# Altium project 220 volts dimmer.PrjPcb
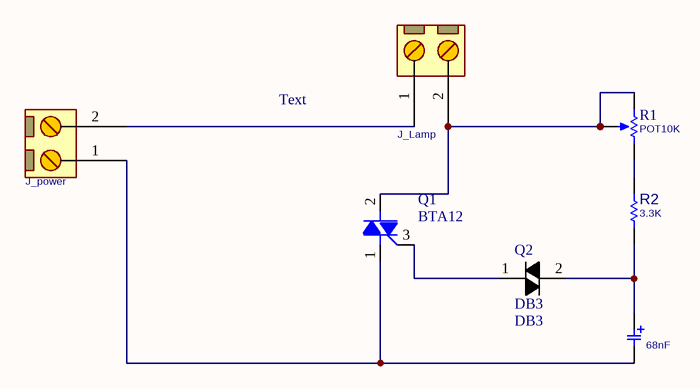
[diagram p0: 220volt dimmer.SchDoc]
1 sheet, 7 parts. Net scope: global (net labels, ports and power ports of the same name join across sheets).
Board file: PCB2.PcbDoc

## Sheet 220volt dimmer.SchDoc
size A4; SheetNumber: 1; SheetTotal: 1

### Parts
J_Lamp  CONN_TB2  [MSTB_2]  (value not drawn)
J_power  CONN_TB2  [MSTB_2]  (value not drawn)
Q1  BTA12  [TO220_3]
Q2  DB3  [D_AX03_DO35]
R1  POT10K  [VOL_R]
R2  3.3K  [R025W_AX04]
  68nF  [C_FLM_7X5H11]

### Nets
NetJ_Lamp_1: J_Lamp.1 J_power.2
NetJ_Lamp_2: J_Lamp.2 Q1.2(T2) R1.1(TOP) R1.2(TAP)
NetJ_power_1: J_power.1 Q1.1(T1) .2
NetQ1_3: Q1.3(G) Q2.1(A1)
NetQ2_2: Q2.2(A2) R2.1 .1
NetR1_3: R1.3(BOT) R2.2

### Notes on the sheet
- Text

### Library data of the parts
J_Lamp J_power = CONN_MSTB_2: CONN, PHOENIX MSTB, 5-G, 5.08mm pitch; PARAM2: 320V; PARAM: 12A; VALUE: CONN_TB2
Q1 = TRIAC_BTA12-600_TO220: Triac, 600V, 12A, TO-220; MANF_P#: BTA12-600BW, BTA12-600CW, BTA12-600TW; MANF: ST; PRICE: 1200toman@PAYA; VALUE: BTA12
Q2 = DIAC_DB3_DO35: Diac, 32VBO, DO-35; MANF: ST; PARAM: 2A, -40~125oC; MANF_P#: DB3; PRICE: toman@PAYA; PARAM2: 32VBO; VALUE: DB3
R1 = RES_THD_POT_VOL: RESISTOR, THD, Potentiometer Volume; VALUE: POT10K
R2 = RES_THD: RESISTOR, THD; MANF_P#: RK73H1ETTP4701F; MANF: KOA SPEER; PARAM: 0.063W; DESC: DESCRIPTION; DIST#: MOUSER; PARAM2: 1%; ASSEMBLY: ASSEMBLY; PRICE: 100= 0.5$; VALUE: 3.3K
 = CAP_THD_FLM: CAP, THD, FILM,; MANF_P#: MANF_PART#; PARAM2: 25V; DESC: DESCRIPTION; DIST#: MOUSER; PARAM: 20%; PRICE: 10= 5$; MANF: MANF; ASSEMBLY: ASSEMBLY; VALUE: 68nF